# EAGLE design PrechargerV2 (EAGLE 7.7.0)
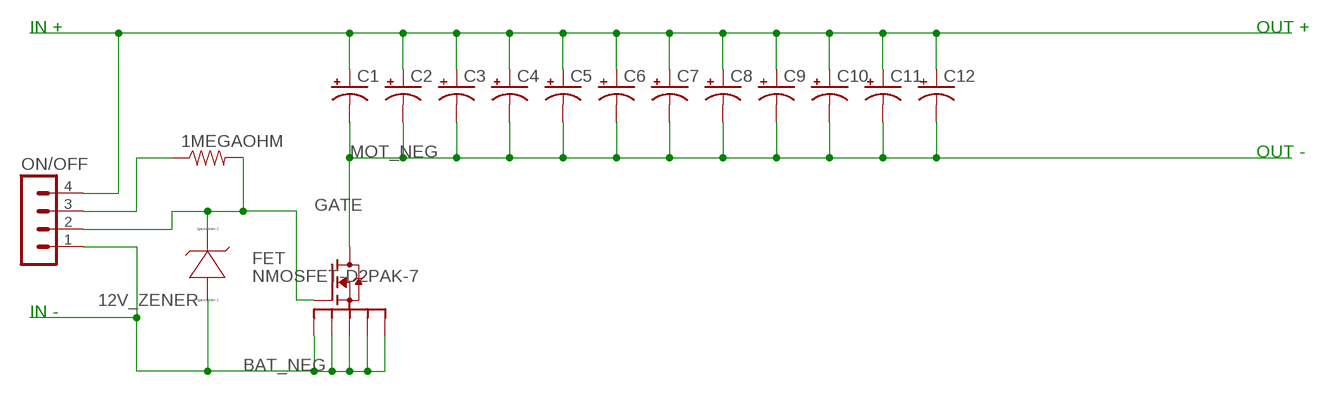
[diagram p0: schematic, sheet 1]

## Parts
1MEGAOHM  RESISTOR0603-RES  [0603-RES]
12V_ZENER  ZENER  [SOD123]
C1  CPOL-USE5-13  [E5-13]
C2  CPOL-USE5-13  [E5-13]
C3  CPOL-USE5-13  [E5-13]
C4  CPOL-USE5-13  [E5-13]
C5  CPOL-USE5-13  [E5-13]
C6  CPOL-USE5-13  [E5-13]
C7  CPOL-USE5-13  [E5-13]
C8  CPOL-USE5-13  [E5-13]
C9  CPOL-USE5-13  [E5-13]
C10  CPOL-USE5-13  [E5-13]
C11  CPOL-USE5-13  [E5-13]
C12  CPOL-USE5-13  [E5-13]
FET  NMOSFET-D2PAK-7  [D2PAK-7]
ON/OFF  MA04-1  [MA04-1]

## Nets
BAT_NEG: 12V_ZENER.A(+) FET.S1 FET.S2 FET.S3 FET.S4 FET.S5 ON/OFF.1
BAT_POS: C1.+ C2.+ C3.+ C4.+ C5.+ C6.+ C7.+ C8.+ C9.+ C10.+ C11.+ C12.+
GATE: 1MEGAOHM.2 12V_ZENER.C(-) FET.G ON/OFF.2
MOT_NEG: C1.- C2.- C3.- C4.- C5.- C6.- C7.- C8.- C9.- C10.- C11.- C12.- FET.D
N$1: 1MEGAOHM.1 ON/OFF.3
Unconnected: ON/OFF.4

## Notes on the sheet
- IN + | OUT +
- OUT -
- IN -

## Library data of the parts
1MEGAOHM = SparkFun-Passives:RESISTOR: Resistor Basic schematic elements and footprints for 0603, 1206, and PTH resistors.
12V_ZENER = sym:ZENER: Zener Diode
C1-C12 = rcl:CPOL-US: POLARIZED CAPACITOR, American symbol
FET = D2PAK-7:NMOSFET-D2PAK-7
ON/OFF = con-lstb:MA04-1: PIN HEADER; OC_FARNELL: unknown; OC_NEWARK: unknown

## Board
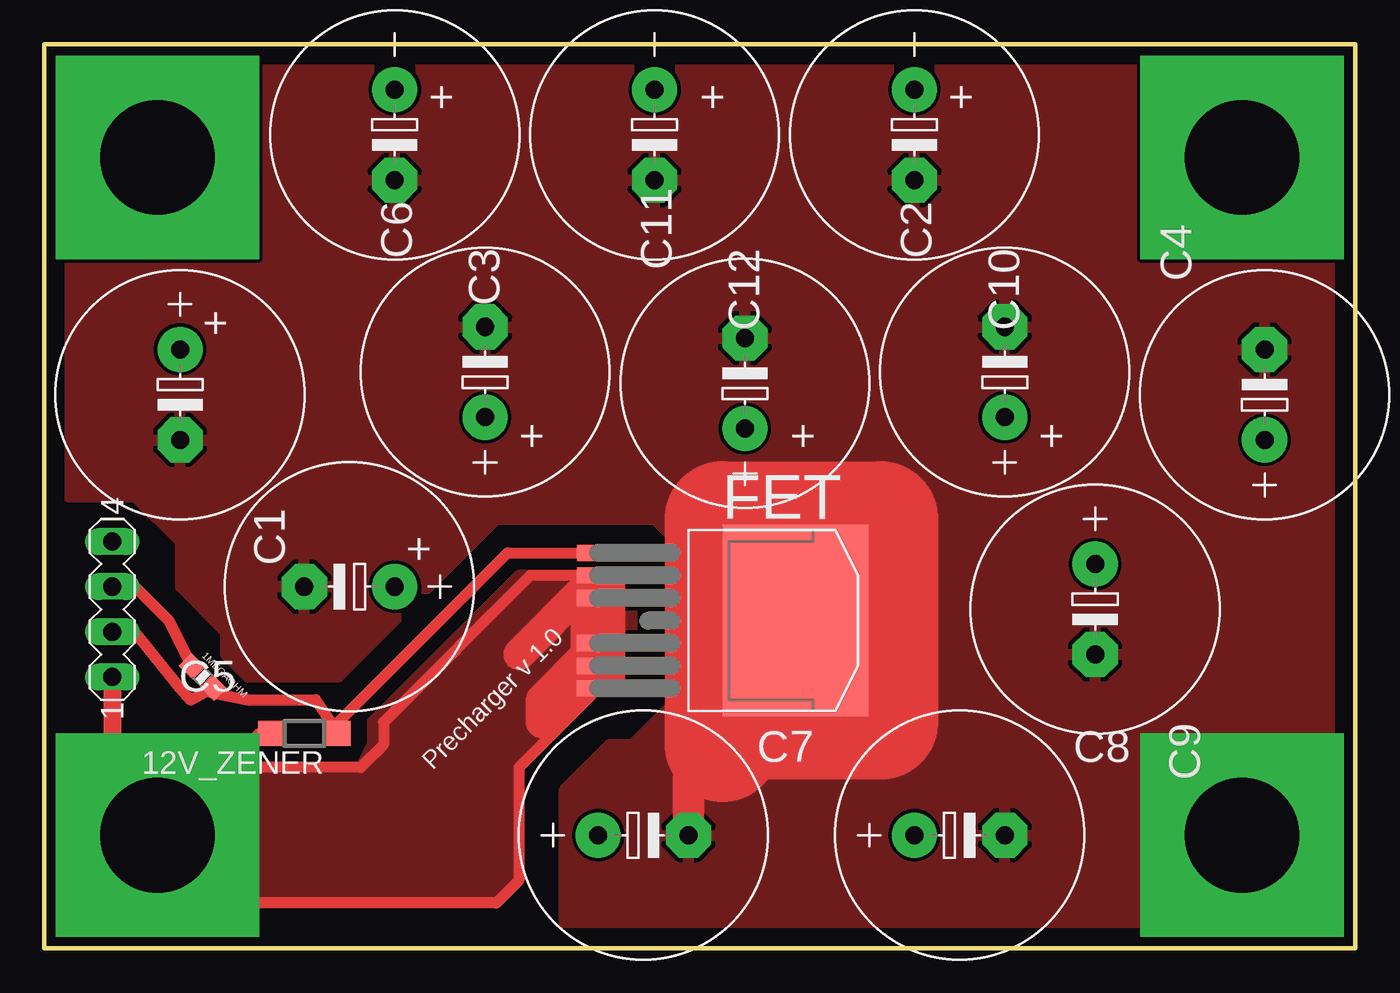
[diagram p1: board, top side]
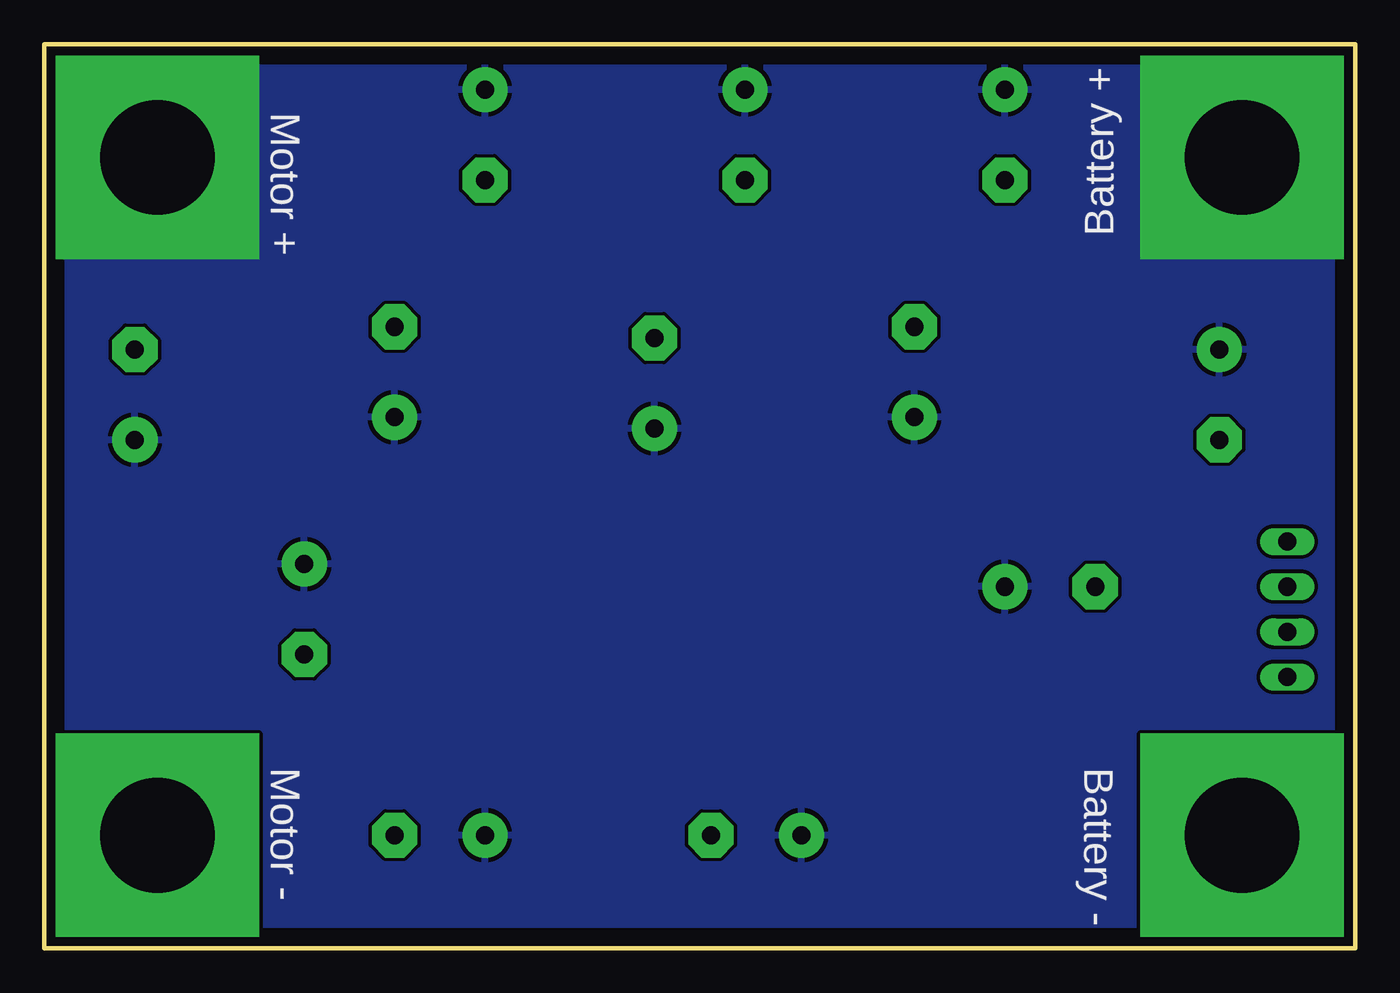
[diagram p2: board, bottom side, seen from below]

Size 73.66 x 50.8 mm. Coordinates in mm from the lower left corner, seen from the top.
Outline: 0,0 73.66,0 73.66,50.8 0,50.8 0,0
Copper layers (1*16): Top 0.035mm / dielectric 1.5mm / Bottom 0.035mm
Design rules "default": minimum track width 10mil, minimum drill 24mil, track to track 8mil, track to pad 8mil, pad to pad 8mil, via to via 8mil, smd to smd 8mil, copper to edge 40mil, drill to drill 8mil, minimum pad ring 10mil, minimum via ring 8mil, stop-mask expansion 4mil, vias tented up to drill 0mil, thermal gap 10mil

### Footprints (pad centres in the part's own frame; a part is rotated, then mirrored left to right if it is on the bottom)
0603-RES = smd 1.1 x 1: 1 -0.85,0; 2 0.85,0
SOD123 = smd 1.4 x 1.4: A 1.9,0; C -1.9,0
E5-13 = drill 1.016 pad 2.54: + -2.54,0 | drill 1.016 pad 2.54 octagon: - 2.54,0
D2PAK-7 = smd 10.8 x 8.15: D 0,4.1 | smd 0.9 x 3.2: G -3.81,-6.56; S1 -2.54,-6.56; S2 -1.27,-6.56; S3 1.27,-6.56; S4 2.54,-6.56; S5 3.81,-6.56
MA04-1 = drill 1.016 long: 1 -3.81,0; 2 -1.27,0; 3 1.27,0; 4 3.81,0

### Placement (x,y rotation side)
1MEGAOHM  8.89,15.24 315 top
12V_ZENER  14.61,12.06 180 top
C1  7.62,31.11 270 top
C2  53.98,32.38 90 top
C3  19.68,45.72 270 top
C4  68.58,31.11 90 top
C5  17.14,20.32 180 top
C6  24.77,32.38 90 top
C7  33.66,6.35 0 top
C8  51.44,6.35 0 top
C9  59.05,19.05 270 top
C10  48.9,45.72 270 top
C11  39.37,31.75 90 top
C12  34.29,45.72 270 top
FET  38.1,18.41 270 top
ON/OFF  3.81,19.05 90 top

### Tracks (layer width: path | path; a pad name or v marks a point on that pad's centre or on a via)
BAT_NEG  (via drill 6.45 pad 11.43)
  Top 0.61: 12V_ZENER.A 12.06,12.06 10.16,10.16 | 10.16,10.16 v6.35,6.35 | 3.81,8.89 v6.35,6.35 | FET.S1 27.3,20.95 19.05,12.7 19.05,11.43 17.78,10.16 10.16,10.16 | FET.S5 31.11,14.61 26.67,10.16 26.67,3.81 25.4,2.54 6.35,2.54 v6.35,6.35
  Top 1.016: ON/OFF.1 3.81,8.89
  Top 1.778: 31.75,20.32 31.75,15.24 30.48,15.24 27.94,12.7 27.94,13.97 30.48,16.51 30.48,20.32 26.67,16.51
  pour Top: 33.02,20.95 26.67,20.95 18.41,12.7 18.41,11.43 17.78,10.16 10.16,10.16 6.35,6.35 6.35,2.54 25.4,2.54 26.67,3.81 26.67,10.16 31.11,14.61 33.02,14.61
BAT_POS  (via drill 6.45 pad 11.43)
  other vias: 6.35,44.45 67.31,44.45
  pour Bottom: 0,50.8 73.66,50.8 73.66,0 0,0
GATE
  Top 0.406: 5.71,17.14 5.08,17.78 ON/OFF.2
  Top 0.61: 5.08,17.78 7.62,14.61 8.22,13.94 1MEGAOHM.2 9.31,14.39 11.43,13.97 15.24,13.97 12V_ZENER.C 16.5,12.7 26.04,22.23 FET.G
MOT_NEG  (via drill 6.45 pad 11.43)
  Top 1.778: FET.D 42.2,15.53 38.1,11.43 36.2,9.53 C7.-
  Top 6.452: 38.1,11.43 38.1,24.13 46.99,24.13 46.99,12.7 39.37,12.7
  other vias: 67.31,6.35
  pour Top: 73.66,0 73.66,50.8 0,50.8 0,26.67 1.27,25.4 5.08,25.4 7.62,22.86 7.62,20.32 10.16,17.78 10.16,16.51 11.43,15.24 16.51,15.24 25.4,24.13 34.29,24.13 35.56,22.86 35.56,13.97 33.02,11.43 31.75,11.43 29.21,8.89 29.21,0
N$1
  Top 0.406: 4.23,19.9 ON/OFF.3
  Top 0.61: 1MEGAOHM.1 7.02,18.38 5.08,20.32 ON/OFF.3
N$6
  Top 0.813: 29.21,13.34 30.48,14.61
(copper drawn outside any net)
  shapes: Top area x1

### Text on the board
tNames: + | + | + | + | + | + | + | + | Precharger v 1.0
bNames: Battery + | Motor + | Battery - | Motor -
tValues: MOTOR + | BAT + | STOP RUN | MOTOR - | BAT -